# Altium schematic sheet Sheet1.SchDoc
size A4
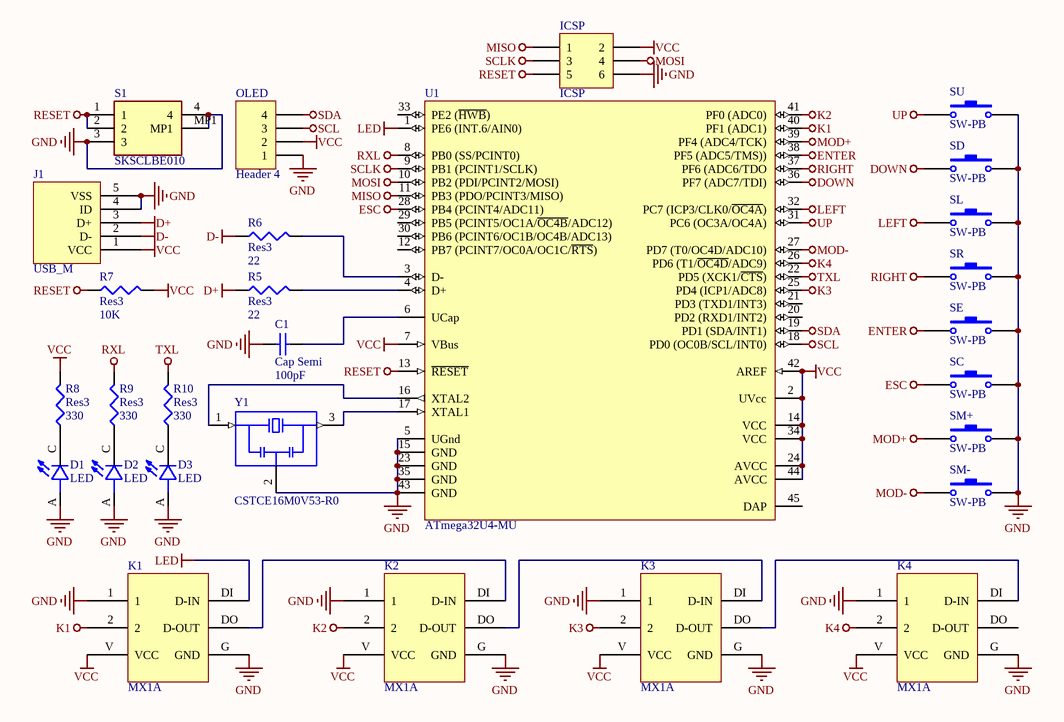
[diagram p0: Sheet1.SchDoc]

## Parts
C1  Cap Semi  value 100pF  [1608[0603]]
D1  LED  [LEDC1608X65N]
D2  LED  [LEDC1608X65N]
D3  LED  [LEDC1608X65N]
ICSP  ICSP  [HDR2X3]
J1  USB_M  [USB_MICRO]
K1  MX1A  [MX1A]
K2  MX1A  [MX1A]
K3  MX1A  [MX1A]
K4  MX1A  [MX1A]
OLED  Header 4  [HDR1X4]
R5  Res3  value 22  [J1-0603]
R6  Res3  value 22  [J1-0603]
R7  Res3  value 10K  [J1-0603]
R8  Res3  value 330  [J1-0603]
R9  Res3  value 330  [J1-0603]
R10  Res3  value 330  [J1-0603]
S1  SKSCLBE010  [SKSCLBE010]
SC  SW-PB  [SW_PB2_B1]
SD  SW-PB  [SW_PB2_B1]
SE  SW-PB  [SW_PB2_B1]
SL  SW-PB  [SW_PB2_B1]
SM+  SW-PB  [SW_PB2_B1]
SM-  SW-PB  [SW_PB2_B1]
SR  SW-PB  [SW_PB2_B1]
SU  SW-PB  [SW_PB2_B1]
U1  ATmega32U4-MU  [44PW_N]
Y1  CSTCE16M0V53-R0  [OSC_CSTCE16M0V53-R0]

## Nets
D+: J1.3(D+) R5.1
D-: J1.2(D-) R6.1
DOWN: SD.1 U1.36(PF7_(ADC7/TDI))
ENTER: SE.1 U1.38(PF5_(ADC5/TMS)))
ESC: SC.1 U1.28(PB4_(PCINT4/ADC11))
GND: C1.1 D1.A D2.A D3.A ICSP.6 J1.4(ID) J1.5(VSS) K1.1 K1.G(GND) K2.1 K2.G(GND) K3.1 K3.G(GND) K4.1 K4.G(GND) OLED.1 S1.3 S1.4 S1.MP1 SC.2 SD.2 SE.2 SL.2 SM+.2 SM-.2 SR.2 SU.2 U1.5(UGnd) U1.15(GND) U1.23(GND) U1.35(GND) U1.43(GND) Y1.2(GND)
K1: K1.2 U1.40(PF1_(ADC1))
K2: K2.2 U1.41(PF0_(ADC0))
K3: K3.2 U1.25(PD4_(ICP1/ADC8))
K4: K4.2 U1.26(PD6_(T1/~{OC4D}/ADC9))
LED: K1.DI(D-IN) U1.1(PE6_(INT.6/AIN0))
LEFT: SL.1 U1.32(PC7_(ICP3/CLK0/~{OC4A}))
MISO: ICSP.1 U1.11(PB3_(PDO/PCINT3/MISO))
MOD+: SM+.1 U1.39(PF4_(ADC4/TCK))
MOD-: SM-.1 U1.27(PD7_(T0/OC4D/ADC10))
MOSI: ICSP.4 U1.10(PB2_(PDI/PCINT2/MOSI))
RESET: ICSP.5 R7.1 S1.1 S1.2 U1.13(~{RESET})
RIGHT: SR.1 U1.37(PF6_(ADC6/TDO)
RXL: R9.2 U1.8(PB0_(SS/PCINT0))
SCL: OLED.3 U1.18(PD0_(OC0B/SCL/INT0))
SCLK: ICSP.3 U1.9(PB1_(PCINT1/SCLK))
SDA: OLED.4 U1.19(PD1_(SDA/INT1))
TXL: R10.2 U1.22(PD5_(XCK1/~{CTS}))
UP: SU.1 U1.31(PC6_(OC3A/OC4A))
VCC: ICSP.2 J1.1(VCC) K1.V(VCC) K2.V(VCC) K3.V(VCC) K4.V(VCC) OLED.2 R7.2 R8.2 U1.2(UVcc) U1.7(VBus) U1.14(VCC) U1.24(AVCC) U1.34(VCC) U1.42(AREF) U1.44(AVCC)
NetC1_2: C1.2 U1.6(UCap)
NetD1_C: D1.C R8.1
NetD2_C: D2.C R9.1
NetD3_C: D3.C R10.1
NetK1_DO: K1.DO(D-OUT) K2.DI(D-IN)
NetK2_DO: K2.DO(D-OUT) K3.DI(D-IN)
NetK3_DO: K3.DO(D-OUT) K4.DI(D-IN)
NetR5_2: R5.2 U1.4(D+)
NetR6_2: R6.2 U1.3(D-)
NetU1_16: U1.16(XTAL2) Y1.1(IN)
NetU1_17: U1.17(XTAL1) Y1.3(OUT)

Not connected (* = marked no-connect by the designer): K4 DO(D-OUT); U1 12(PB7_(PCINT7/OC0A/OC1C/~{RTS})) 20(PD2_(RXD1/INT2)) 21(PD3_(TXD1/INT3)) 29(PB5_(PCINT5/OC1A/~{OC4B}/ADC12)) 30(PB6_(PCINT6/OC1B/OC4B/ADC13)) 33(PE2_(~{HWB})) 45(DAP)

## Library data of the parts
C1 = Cap Semi: Capacitor (Semiconductor SIM Model); Published: 8-Jun-2000; LatestRevisionDate: 29-May-2009; LatestRevisionNote: IPC-7351 Footprint Added.; PackageReference: C1206; Publisher: Altium Limited; PackageDescription: Chip Capacitor
D1-D3 = LTW-C191TLA: White LED Indication - Discrete 3.1V 0603 _1608 Metric_; MF: Lite-On; MP: LTW-C191TLA; Package: 0603 Lite-On; SnapEDA_Link: https://www.snapeda.com/parts/LTW-C191TLA/Lite-On/view-part/538855/?ref=snap; Availability: Unavailable; Price: None; Value: *
ICSP = Header 3X2: Header, 3-Pin, Dual row; LatestRevisionDate: 17-Jul-2002; LatestRevisionNote: Re-released for DXP Platform.; Publisher: Altium Limited
J1 = USB_M: MicroUSB諉諳
OLED = Header 4: Header, 4-Pin; LatestRevisionDate: 17-Jul-2002; LatestRevisionNote: Re-released for DXP Platform.; Publisher: Altium Limited
R5-R10 = Res3: Resistor; Published: 8-Jun-2000; LatestRevisionDate: 29-May-2009; LatestRevisionNote: IPC-7351 Footprint Added.; PackageReference: J1-0603; Publisher: Altium Limited; PackageDescription: Chip Resistor
S1 = SKSCLBE010: Switch; Manufacturer_Name: ALPS; Datasheet Link: https://componentsearchengine.com/Datasheets/1/SKSCLBE010.pdf; Height: 1.25mm; Manufacturer_Part_Number: SKSCLBE010
SC SD SE SL SM+ SM- SR SU = SW-PB: 峚雄羲壽; Published: 24-Mar-1999; LatestRevisionDate: 17-Jul-2002; LatestRevisionNote: Re-released for DXP Platform.; PackageReference: SPST-2; Publisher: Altium Limited
U1 = ATmega32U4-MU: 8-bit AVR Microcontroller, 2.7-5.5V, 32KB Flash, 2.5KB EEPROM, 1KB SRAM, USB Controller, 44-pin QFN, Industrial Grade (-40蚓 to 85蚓); Published: 1-Apr-2010; DatasheetVersion: revD, Jan-2009; PackageVersion: revF, Jul-2007; PackageReference: 44PW; Publisher: Altium Limited; PackageDescription: 44-Pin Quad Flat No-Lead Package, 7 x 7 mm Body, 0.5 mm Pitch (QFN); Supplier 1: Digi-Key; Supplier Part Number 1: ATMEGA32U4-MU-ND; Supplier 2: Mouser; Supplier Part Number 2: 556-ATMEGA32U4-MU; Code_JEDEC: MO-220-VKKD-1; ComponentLink1Description: Manufacturer Link; ComponentLink1URL: http://www.atmel.com/products/avr/default.asp?; ComponentLink2Description: ATmega16U4/32U4 Datasheet; ComponentLink2URL: http://www.atmel.com/dyn/resources/prod_documents/doc7766.pdf; ComponentLink3Description: ATmega16U4 ATmega32U4 Summary; ComponentLink3URL: http://www.atmel.com/dyn/resources/prod_documents/7766S.pdf; ComponentLink4Description: Atmel.com Home; ComponentLink4URL: http://www.atmel.com
Y1 = CSTCE16M0V53-R0: 16MHz Ceramic Resonator Built in Capacitor 15pF Â±0.3% -20Â°C ~ 80Â°C Surface Mount; MF: Murata; Price: None; Value: *; Availability: Unavailable; SnapEDA_Link: https://www.snapeda.com/parts/CSTCE16M0V53-R0/Murata%20Electronics%20North%20America/view-part/47416/?ref=snap; MP: CSTCE16M0V53-R0; Package: SMD-3 Murata